# EasyEDA Pro project PCB_PCB_【CW32】芯源4轴飞行器_2022-08-28.eprj

# Board PCB_PCB_【CW32】芯源4轴飞行器_2022-08-28
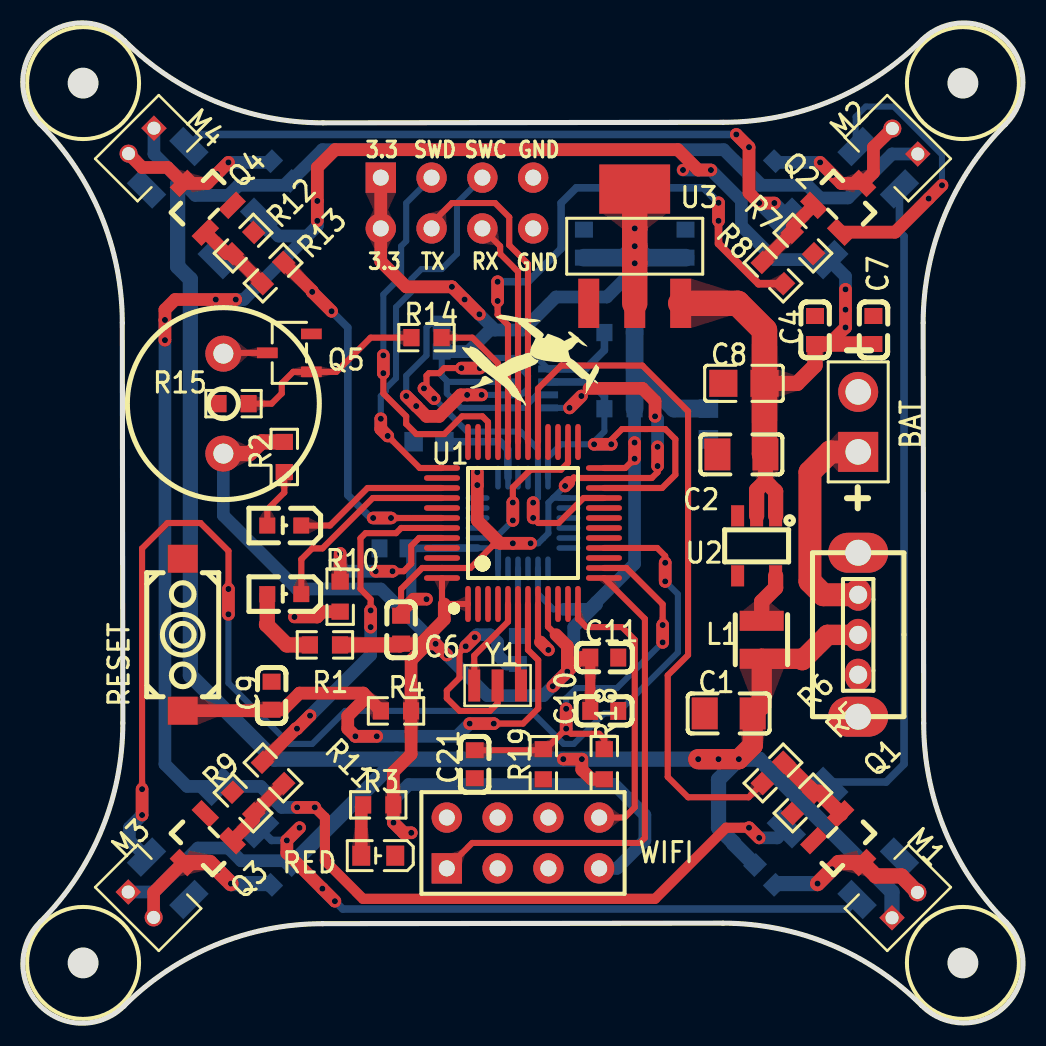
[diagram p0: board, top side]
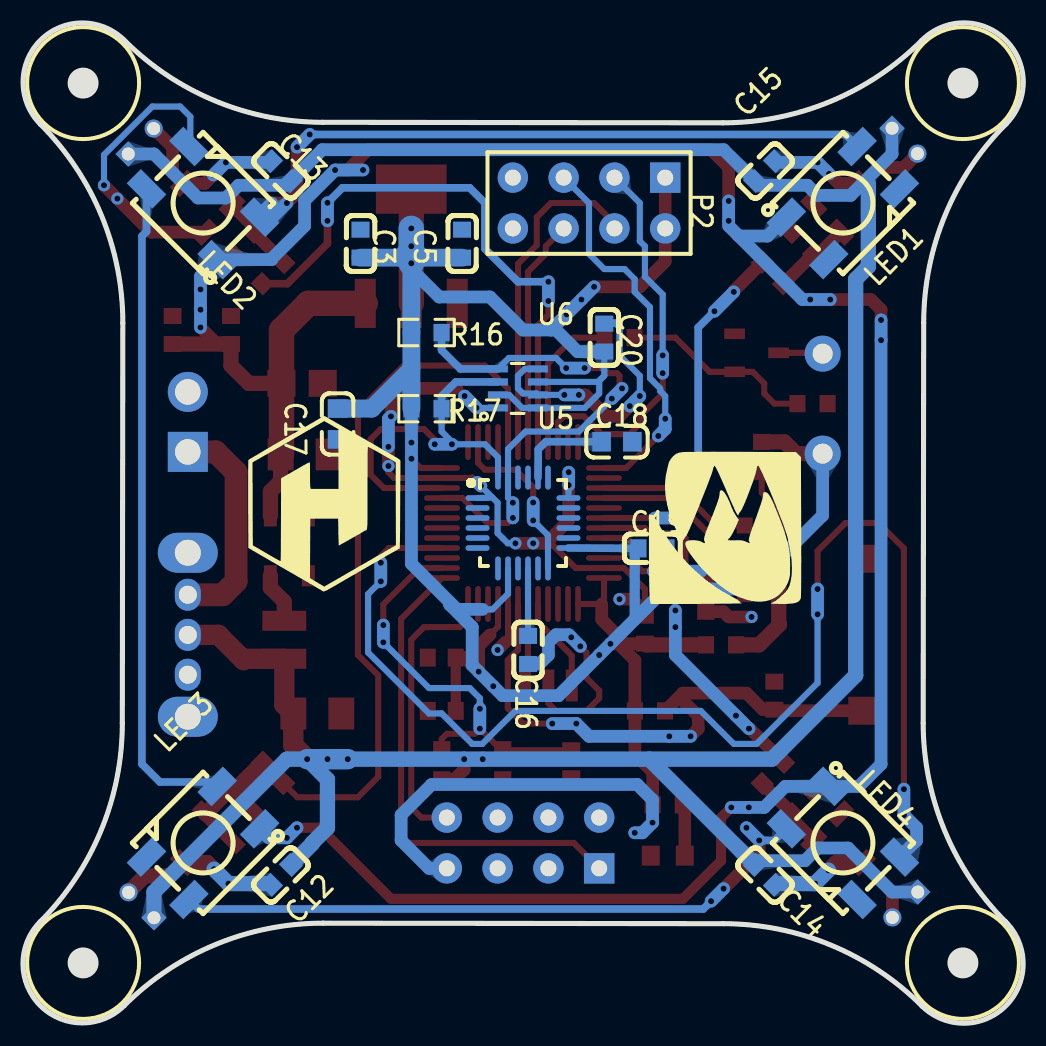
[diagram p1: board, bottom side, seen from below]

Outline 50.03 x 50.03 mm; copper layers: Top Layer, Bottom Layer. Coordinates in mm from the lower left corner of the outline.
Outline path: 0.86,44.97 arc(3.91,40.41) 4.98,35.03 5,15.02 arc(3.93,9.64) 0.89,5.08 arc(0.87,0.88) 5.06,0.86 5.06,0.86 arc(9.62,3.91) 15,4.98 35.02,5 arc(40.4,3.93) 44.96,0.89 arc(49.15,0.87) 49.17,5.06 arc(46.13,9.62) 45.06,15 45.03,35.02 arc(46.1,40.4) 49.15,44.96 arc(49.17,49.15) 44.97,49.17 arc(40.41,46.13) 35.03,45.06 15.02,45.03 arc(9.64,46.1) 5.08,49.15 arc(0.88,49.17) 0.86,44.97
Stack: Top Layer 0.035mm / Dielectric1 1.51mm FR4 er 4.5 / Bottom Layer 0.035mm

## Design rules (mm)
spacing Default (default): track to track 0.152, other pairs 0 to 0.152
track width Default (default): min 0.254, default 0.254, max 25.4
differential pair differentialPair (default): width min 0.127, default 0.254, max 2.54; gap min 0.152, default 0.152
via Default (default): diameter min 0.61, default 0.61, max 100.025; hole min 0.305, default 0.305, max 59.995
net GND uses gge22173
pour e870 uses gge22173

## Placement (name value [footprint] x y rotation side)
BAT  -  [R-BAT]  41.78 28.57 90 top
BUZZER1  HNB09A05  [BUZ-TH_BD9.6-P5.00-D0.7-FD]  10.03 30.99 90 top
C1  10uF  [C 1206]  35.3 15.49 180 top
C2  100uF  [C 1206]  35.94 28.45 180 top
C3  100nF  [C0603]  33.14 38.99 270 bottom
C4  100nF  [C0603]  39.62 34.67 270 top
C5  1uF  [C0603]  28.06 38.99 270 bottom
C6  100nF  [C0603]  18.92 19.68 90 top
C7  100nF  [C0603]  42.54 34.67 270 top
C8  10uF  [C0805]  36.07 32 0 top
C9  100nF  [C0603]  12.44 16.38 270 top
C10  1uF  [C0603]  29.08 15.62 0 top
C11  100nF  [C0603]  29.08 18.29 180 top
C12  4.7uF  [C0603]  37.12 7.42 135 bottom
C13  4.7uF  [C0603]  37.12 42.62 225 bottom
C14  4.7uF  [C0603]  12.92 7.42 45 bottom
C15  4.7uF  [C0603]  12.92 42.62 315 bottom
C16  100nF  [C0603]  24.76 18.67 90 bottom
C17  10nF  [C  0603]  34.29 29.97 270 bottom
C18  2.2nF  [C  0603]  20.32 29.08 180 bottom
C19  100nF  [C0603]  18.54 23.75 180 bottom
C20  100nF  [C0603]  20.95 34.29 270 bottom
C21  100nF  [C0603]  22.6 12.95 90 top
D1  LED_BLUE2  [LED0603-R-RD]  13.08 24.89 180 top
D7  LED_BLUE1  [LED0603-R-RD]  13.08 21.46 180 top
L1  22uH  [IND-SMD_L2.5-W2.0_SWPA252012S]  36.95 19.17 90 top
LED1  WS2812B  [LED-SMD_4P-L5.0-W5.0-TL]  9.02 41.02 135 bottom
LED2  WS2812B  [LED-SMD_4P-L5.0-W5.0-TL]  41.02 41.02 45 bottom
LED3  WS2812B  [LED-SMD_4P-L5.0-W5.0-TL]  41.02 9.02 315 bottom
LED4  WS2812B  [LED-SMD_4P-L5.0-W5.0-TL]  9.02 9.02 225 bottom
M1  PH2.0  [R-MOTOR]  44.12 5.92 45 top
M2  PH2.0  [R-MOTOR]  44.12 44.12 135 top
M3  PH2.0  [R-MOTOR]  5.92 5.92 315 top
M4  PH2.0  [R-MOTOR]  5.92 44.12 225 top
P2  扩展接口  [排针排母2*4P]  21.71 41.02 270 bottom
Q1  SI2302  [R-SOT-23]  41.12 8.92 135 top
Q2  SI2302  [R-SOT-23]  41.12 41.12 225 top
Q3  SI2302  [R-SOT-23]  8.92 8.92 45 top
Q4  SI2302  [R-SOT-23]  8.92 41.12 315 top
Q5  S8050_C2146  [SOT-23-3_L3.0-W1.7-P0.95-LS2.9-BR]  13.33 33.53 0 top
R1  2K  [R0603]  15.11 18.92 0 top
R2  2K  [R0603]  13.08 28.32 90 top
R3  2K  [R0603]  17.78 10.92 0 top
R4  10K  [R0603]  18.67 15.62 0 top
R5  10K  [R0603]  39.02 11.02 45 top
R6  100  [R0603]  37.52 12.52 225 top
R7  10K  [R0603]  39.02 39.02 135 top
R8  100  [R0603]  37.52 37.52 315 top
R9  10K  [R0603]  11.02 11.02 315 top
R10  10K  [R0603]  15.87 21.33 270 top
R11  100  [R0603]  12.52 12.52 135 top
R12  10K  [R0603]  11.02 39.02 225 top
R13  100  [R0603]  12.52 37.52 45 top
R14  1kΩ  [R0603]  20.19 34.29 180 top
R15  10K  [R0603]  10.54 30.99 0 top
R16  4.7kΩ  [R0603]  29.84 34.54 0 bottom
R17  4.7kΩ  [R0603]  29.84 30.73 0 bottom
R18  100kΩ  [R0603]  29.08 12.95 270 top
R19  10K  [R0603]  26.03 12.95 90 top
RED  19-21/R6C-FP1Q2L/3T  [LED0603-FD]  17.78 8.38 0 top
RESET  SWITCH  [KEY-SMD_2P-L6.2-W3.6-LS8.0]  8 19.43 270 top
SWITCH_POWER1  SS-12D02-VG4  [SW-TH_SS-12D02-VG4]  41.78 19.43 90 top
TP1  -  [M3铜柱]  3.02 47.02 0 top
TP2  -  [M3铜柱]  47.02 47.02 0 top
TP3  -  [M3铜柱]  3.02 3.02 0 top
TP4  -  [M3铜柱]  47.02 3.02 0 top
U1  CW32F030C8  [LQFP-48_L7.0-W7.0-P0.50-LS9.0-TL]  25.02 25.02 90 top
U2  R-ME2188C50M5G  [R-SOT-23-5]  36.7 23.87 270 top
U3  SC1117-3.3V  [SOT-223_L6.5-W3.5-P2.30-LS7.0-BR]  30.6 38.86 270 top
U5  MPU6050  [R-QFN 24]  25.02 25.02 270 bottom
U6  FBM320/BMP280  [R-BMP280]  25.27 31.75 0 bottom
WIFI  扩展接口  [排针排母2*4P]  25.02 9.01 90 top
Y1  8MHz  [R-CSTSE800G52]  23.75 16.89 0 top

## Footprints (pads in the part's own frame, mm; a bottom-side part is the same pattern mirrored in y, then rotated)
BUZ-TH_BD9.6-P5.00-D0.7-FD
  round 1.8 hole 1: 1(-2.5,0) 2(2.5,0)
C0603
  rect 0.8x0.9 smd: 1(-0.7,0) 2(0.7,0)
C0805
  rect 1.41x1.35 smd: 1(-1.03,0) 2(1.03,0)
C 1206
  rect 1.3x1.6 smd: 1(-1.2,0) 2(1.2,0)
C  0603
  custom 0.93x0.98 smd: 1(-0.769,0) 2(0.77,0)
IND-SMD_L2.5-W2.0_SWPA252012S
  rect 1x2.2 smd: 1(-0.951,0) 2(0.951,0)
KEY-SMD_2P-L6.2-W3.6-LS8.0
  rect 1.4x1.5 smd: 1(-3.8,0) 2(3.8,0)
LED0603-FD
  rect 0.9x1 smd: 1(-0.85,0) 2(0.85,0)
LED0603-R-RD
  rect 0.8x0.8 smd: 1(0.851,0) 2(-0.851,0)
LED-SMD_4P-L5.0-W5.0-TL
  rect 1.8x1 smd: 1(-2.5,1.5) 2(-2.5,-1.5) 3(2.5,-1.5) 4(2.5,1.5)
LQFP-48_L7.0-W7.0-P0.50-LS9.0-TL
  oval 1.8x0.28 smd: 1(-4.05,2.75) 2(-4.05,2.25) 3(-4.05,1.75) 4(-4.05,1.25) 5(-4.05,0.75) 6(-4.05,0.25) 7(-4.05,-0.25) 8(-4.05,-0.75) 9(-4.05,-1.25) 10(-4.05,-1.75) 11(-4.05,-2.25) 12(-4.05,-2.75) 25(4.05,-2.75) 26(4.05,-2.25) 27(4.05,-1.75) 28(4.05,-1.25) 29(4.05,-0.75) 30(4.05,-0.25) 31(4.05,0.25) 32(4.05,0.75) 33(4.05,1.25) 34(4.05,1.75) 35(4.05,2.25) 36(4.05,2.75)
  oval 0.28x1.8 smd: 13(-2.75,-4.05) 14(-2.25,-4.05) 15(-1.75,-4.05) 16(-1.25,-4.05) 17(-0.75,-4.05) 18(-0.25,-4.05) 19(0.25,-4.05) 20(0.75,-4.05) 21(1.25,-4.05) 22(1.75,-4.05) 23(2.25,-4.05) 24(2.75,-4.05) 37(2.75,4.05) 38(2.25,4.05) 39(1.75,4.05) 40(1.25,4.05) 41(0.75,4.05) 42(0.25,4.05) 43(-0.25,4.05) 44(-0.75,4.05) 45(-1.25,4.05) 46(-1.75,4.05) 47(-2.25,4.05) 48(-2.75,4.05)
R0603
  rect 0.806x0.864 smd: 1(-0.753,0) 2(0.753,0)
R-BAT
  rect 2x2 hole 1.275x1.27: 1(0,0)
  round 2 hole 1.275x1.27: 2(3,0)
R-BMP280
  custom 1x0.35 smd: 1(1.002,0.975) 2(1.002,0.325) 3(1.002,-0.325) 4(1.002,-0.975) 5(-1.002,-0.975) 6(-1.002,-0.325) 7(-1.002,0.325) 8(-1.002,0.975)
R-CSTSE800G52
  rect 0.6x1.6 smd: 1(-1.169,0) 2(1.169,0) 3(0,0)
R-MOTOR
  rect 0.9x0.9 hole 0.65x0.65: 1(-0.911,0)
  round 0.9 hole 0.65x0.65: 2(0.886,0)
R-QFN 24
  custom 0.28x1.199 smd: 1(-1.25,-2.273) 2(-0.75,-2.273) 3(-0.25,-2.273) 4(0.25,-2.273) 5(0.75,-2.273) 6(1.25,-2.273) 13(1.25,2.273) 14(0.75,2.273) 15(0.25,2.273) 16(-0.25,2.273) 17(-0.75,2.273) 18(-1.25,2.273)
  custom 1.199x0.28 smd: 7(2.273,-1.25) 8(2.273,-0.75) 9(2.273,-0.25) 10(2.273,0.25) 11(2.273,0.75) 12(2.273,1.25) 19(-2.273,1.25) 20(-2.273,0.75) 21(-2.273,0.25) 22(-2.273,-0.25) 23(-2.273,-0.75) 24(-2.273,-1.25)
R-SOT-23
  custom 0.7x1.25 smd: 1(1.25,-0.95) 2(1.25,0.95) 3(-1.25,0)
R-SOT-23-5
  rect 1.06x0.65 smd: 1(-1.5,0.95) 2(-1.5,0) 3(-1.5,-0.95) 4(1.5,-0.95) 5(1.5,0.95)
SOT-23-3_L3.0-W1.7-P0.95-LS2.9-BR
  rect 1.038x0.532 smd: 1(1.101,-0.95) 2(1.101,0.95) 3(-1.101,0)
SOT-223_L6.5-W3.5-P2.30-LS7.0-BR
  rect 2.465x1.05 smd: 1(2.857,-2.3) 2(2.857,0) 3(2.857,2.3)
  rect 2.465x3.54 smd: 4(-2.857,0)
SW-TH_SS-12D02-VG4
  oval 1.6x1.3 hole 0.9: 1(-2,0) 2(-0.006,0) 3(2,0)
  oval 2x3 hole 1.3: 4(4.1,0) 5(-4.1,0)
排针排母2*4P
  rect 1.52x1.52 hole 0.8: 1(-1.27,3.81)
  round 1.52 hole 0.8: 2(1.27,3.81) 3(-1.27,1.27) 4(1.27,1.27) 5(-1.27,-1.27) 6(1.27,-1.27) 7(-1.27,-3.81) 8(1.27,-3.81)

## Nets
3.3V: BUZZER1.1 C3.2 C5.2 C6.1 C10.1 C11.2 C17.1 C19.1 C20.2 P2.1 P2.2 R1.2 R2.2 R3.2 R4.2 R16.2 R17.2 U1.1 U1.9 U1.24 U1.48 U3.2 U3.4 U5.8 U5.13 U6.2 U6.6 U6.8 WIFI.7
3.7V: C1.1 C12.2 C13.2 C14.2 C15.2 L1.1 M1.1 M2.1 M3.1 M4.1 R18.2 SWITCH_POWER1.2
+5V: C2.1 C4.2 C7.2 C8.2 LED1.1 LED2.1 LED3.1 LED4.1 U2.1 U2.2 U3.3
GND: BAT.2 C1.2 C2.2 C3.1 C4.1 C5.1 C6.2 C7.1 C8.1 C9.1 C10.2 C11.1 C16.1 C17.2 C18.2 C19.2 C20.1 C21.1 LED1.3 LED2.3 LED3.3 LED4.3 P2.7 P2.8 Q1.2 Q2.2 Q3.2 Q4.2 Q5.2 R5.1 R7.1 R9.1 R10.2 R12.1 R15.1 R19.1 RED.2 RESET.1 U1.8 U1.23 U1.47 U2.4 U3.1 U5.1 U5.9 U5.11 U5.18 U6.1 U6.5 U6.7 WIFI.2 Y1.3
VBAT-T: C21.2 R18.1 R19.2 U1.14
BAT1_1: BAT.1 SWITCH_POWER1.3
BUZZER: R14.1 U1.33
D1_1: D1.1 R2.1
D7_1: D7.1 R1.1
INT: U1.26 U5.12
LED1_4: LED1.4 LED2.2
LED2_4: LED2.4 LED3.2
LED3_4: LED3.4 LED4.2
M1_2: C12.1 M1.2 Q1.3
PF0: U1.5 Y1.1
PF1: U1.6 Y1.2
PWM1: R6.2 U1.29
PWM2: R8.2 U1.32
PWM3: R13.2 U1.42
PWM4: R11.2 U1.43
Q1_1: Q1.1 R5.2 R6.1
Q2_3: C13.1 M2.2 Q2.3
Q3_3: C14.1 M3.2 Q3.3
Q4_3: C15.1 M4.2 Q4.3
Q5_1: Q5.1 R14.2 R15.2
Q5_3: BUZZER1.2 Q5.3
R3_1: R3.1 RED.1
R7_2: Q2.1 R7.2 R8.1
R9_2: Q3.1 R9.2 R11.1
R12_2: Q4.1 R12.2 R13.1
RGB: LED4.4 U1.16
RST: C9.2 R4.1 RESET.2 U1.7
RX_WIFI: U1.13 WIFI.1
RXD: P2.6 U1.31
SCL: R16.1 U1.21 U5.23 U6.4
SDA: R17.1 U1.22 U5.24 U6.3
SWCLK: P2.5 U1.37
SWDIO: P2.3 U1.34
TX_WIFI: U1.12 WIFI.8
TXD: P2.4 U1.30
U1_44: R10.1 U1.44
U2_5: L1.2 U2.5
U5_10: C16.2 U5.10
U5_20: C18.1 U5.20
USER_LED1: D7.2 U1.40
USER_LED2: D1.2 U1.39

Pads without a net: LED1 2; SWITCH_POWER1 1 4 5; U1 2 3 4 10 11 15 17 18 19 20 25 27 28 35 36 38 41 45 46; U2 3; U5 2 3 4 5 6 7 14 15 16 17 19 21 22; WIFI 3 4 5 6

## Via types
v1: diameter 0.61, hole 0.305, Top Layer to Bottom Layer, 114 vias

## Routing (per net, layer and track width the routed paths; a pad name or vN(x,y) marks a point on that pad's centre or on a via; arc(x,y) is an arc through that point)
3.3V: length 168.1
  Top Layer w0.305: 29.07,27.77 30.13,27.77 30.6,28.23 ; 20.96,22.27 20.96,21.19 21.22,20.97 22.27,20.97 ; 26.27,20.97 26.27,19.83 26.67,19.43
  Top Layer w0.508: C10.1 C11.2
  Top Layer w0.635: v1(26.51,16.85) v1(27.23,17.58) 27.23,18.86 26.67,19.43 ; v1(22.83,35.45) v1(22.1,36.19) v1(21.46,36.83) 19.17,36.83 17.9,38.1 P2.1 ; v1(19.43,9.52) 19.05,9.52 v1(18.54,10.03) 18.53,10.92 18.53,12.56 19.42,13.45 R4.2 19.42,18.15 20.24,18.97 v1(20.64,18.97) ; v1(20.64,18.97) v1(21.21,18.41) ; v1(20.64,18.97) C6.1 ; 19.89,18.98 21.08,20.19 21.08,20.97 ; 27.23,17.58 27.94,18.29 C11.2 ; v1(30.6,29.04) v1(30.6,28.23)
  Top Layer w0.762: BUZZER1.1 11.34,28.49 11.94,29.07 13.08,29.07 ; R1.2 18.86,18.92 C6.1
  Top Layer w1.27: U3.2 v1(30.6,38.01) v1(30.6,38.86) v1(30.6,39.75) U3.4
  Bottom Layer w0.305: 20.95,32.38 21.26,32.07 24.27,32.07 ; 20.95,32.38 21.21,32.13 21.21,31.49 21.93,30.77 25.06,30.77 25.71,31.42 U6.2 ; 20.95,32.38 C20.2 ; U5.8 25.77,21.47 26.54,20.7 27.05,20.7
  Bottom Layer w0.381: 22.74,23.77 19.24,23.75
  Bottom Layer w0.508: 19.43,20.19 19.43,23.56 19.24,23.75
  Bottom Layer w0.635: C20.2 22.28,33.59 23.37,34.67 23.62,34.67 ; 23.62,34.67 v1(22.83,35.45) v1(22.1,36.19) v1(21.46,36.83) ; 23.62,34.67 25.02,34.67 26.67,36.32 29.21,36.32 30.6,37.72 v1(30.6,38.01) ; BUZZER1.1 10.03,25.4 13.71,21.71 17.9,21.71 v1(20.64,18.97) v1(21.21,18.41) 23.24,16.38 26.03,16.38 v1(26.51,16.85) v1(27.23,17.58) 27.56,17.9 27.56,19.81 28.69,20.94 28.69,21.07 ; v1(19.43,9.52) 19.05,9.52 v1(18.54,10.03) 18.54,11.17 19.3,11.94 29.59,11.94 31.11,10.41 31.11,9.14 29.72,7.74 WIFI.7 ; R17.2 v1(30.6,29.04) v1(30.6,28.23) 30.6,22.98 28.32,20.7 27.05,20.7
  Bottom Layer w0.889: 33.14,38.29 31.15,38.29 30.6,38.83 ; 30.6,38.82 30.07,38.29 28.06,38.29 ; C17.1 32.58,30.74 30.6,32.72 ; v1(30.6,38.01) R16.2 R17.2
  Bottom Layer w1.27: v1(30.6,39.75) v1(30.6,38.01)
3.7V: length 148
  Top Layer w0.635: 27.03,13.21 v1(27.96,13.21) 27.96,12.67 28.45,12.2 R18.2
  Top Layer w1.016: SWITCH_POWER1.2 40.25,19.42 38.99,18.16 38.92,18.22 L1.1 36.95,15.94 C1.1 36.51,13.9 v1(35.81,13.21) v1(34.79,13.21) v1(33.78,13.21)
  Bottom Layer w0.635: C14.2 13.2,8.13 10.92,8.13 10.28,8.76 8.76,8.76 6.56,6.56 M3.1 ; 6.56,44.76 6.56,43.47 8.63,41.4 10.28,41.4 10.79,41.91 13.2,41.91 C15.2 14.98,43.69 35.06,43.69 C13.2 36.83,41.91 39.24,41.91 39.88,41.27 41.27,41.27 43.47,43.47 M2.1
  Bottom Layer w0.762: 27.03,13.21 v1(27.96,13.21) v1(33.78,13.21) ; v1(27.03,13.21) 18.7,13.21 ; 18.71,13.21 12.57,13.21 8.38,17.4 8.38,37.21 7.74,37.84 7.74,42.01 ; 18.7,13.21 C14.2 ; 43.47,5.27 43.47,6.56 36.83,13.21 v1(35.81,13.21) 34.8,12.19 34.8,9.78 35.56,9.01 35.56,8.98 C12.2
  Bottom Layer w1.016: v1(35.81,13.21) v1(34.79,13.21) v1(33.78,13.21)
+5V: length 140.4
  Top Layer w0.508: v1(36.32,9.78) 35.18,9.78 31.62,6.22 17.02,6.22 15.11,8.13 15.11,10.28 v1(14.6,10.79)
  Top Layer w0.635: C4.2 40.32,33.97 v1(41.15,34.8) v1(41.15,35.68) v1(41.15,36.7) ; v1(7.11,34.16) v1(7.11,35.17) 7.11,35.68 7.62,36.19 v1(9.65,36.19) v1(10.65,36.19) ; v1(14.73,40.13) v1(14.73,41.12) 14.73,42.8 15.62,43.69 32.76,43.69 33.78,42.67 v1(34.41,42.67) ; v1(36.32,9.78) v1(36.83,9.27) ; v1(13.72,10.79) v1(14.6,10.79)
  Top Layer w0.762: 37.09,32 38.73,32 39.62,32.89 C4.2 C7.2 ; 37.14,27.11 36.7,26.67 36.7,25.37 ; 37.14,27.11 37.65,26.59 37.65,25.37 ; 37.14,27.11 37.14,28.45
  Top Layer w1.27: 37.14,28.45 37.09,28.49 37.09,34.66 35.75,36 32.9,36
  Bottom Layer w0.635: v1(36.32,9.78) v1(36.83,9.27) 37.73,9.27 LED3.1 ; v1(13.72,10.79) v1(14.6,10.79) ; 14.22,39.37 12.79,39.37 LED1.1 ; 14.22,39.37 11.05,36.19 v1(10.65,36.19) v1(9.65,36.19) ; 14.22,39.37 14.73,39.88 v1(14.73,40.13) v1(14.73,41.12) ; v1(41.15,34.8) v1(41.15,35.68) v1(41.15,36.7) 41.15,37.35 40.31,38.19 37.59,38.19 37.59,38.22 35.94,39.88 35.94,41.15 v1(34.41,42.67) v1(33.02,42.67) ; 13.72,10.79 12.95,10.79 11.9,11.84 8.22,11.84 7.11,12.95 v1(7.11,34.16) v1(7.11,35.17)
GND: length 82.4
  Top Layer w0.305: U1.8 25.77,19.19 ; 27.59,27.27 U1.23 31.46,27.27 31.75,27.56 v1(31.75,27.87) ; 27.59,27.27 27.56,27.3 ; 27.59,27.27 27.37,27.05 27.3,27.05 ; Y1.3 23.75,16 23.37,15.62 21.84,15.62 21.21,16.25 21.21,16.63 21.84,17.27 21.84,18.54 v1(22.15,18.85) ; v1(24.51,24) 24.38,23.87 23.49,23.87 22.39,22.77 U1.47 19.97,22.77 18.92,21.71 C6.2 ; v1(27.94,31.37) 28.32,31.75
  Top Layer w0.635: v1(20.19,21.21) 19.56,21.21 18.92,20.57 C6.2 ; v1(25.4,24) v1(24.51,24) 23.87,24 22.73,25.14 v1(22.73,26.91) v1(22.73,27.56) ; v1(22.95,31.42) v1(22.22,31.42) 21.9,31.42 20.83,30.35 20.19,30.35 v1(19.68,30.86) v1(19.17,31.37) ; v1(31.62,30.35) 31.62,31.11 30.99,31.75 28.32,31.75 ; 27.3,27.05 v1(27.12,26.87) ; v1(27.94,31.37) v1(27.34,30.77) ; Q2.2 43.62,39.56 v1(45.3,41.24) v1(45.97,41.91) ; v1(22.15,18.85) v1(22.6,19.3) ; R10.2 14.99,20.58 14.73,20.32 v1(13.59,20.32) ; v1(26.29,18.67) 25.89,19.06 ; v1(31.75,27.87) v1(31.75,28.83)
  Bottom Layer w0.305: v1(45.97,41.91) 45.97,43.43 43.56,45.84 42.16,45.84 41.65,45.34 41.65,43.92 LED2.3 ; v1(25.4,24) 25.78,24 26.29,24.51 26.29,26.03 26.54,26.29 ; v1(22.95,31.42) U6.7 24.34,31.49 25.02,31.49 25.27,31.75 25.27,32.38 24.93,32.72 U6.5 ; 26.54,26.29 27.29,26.27 ; 26.54,26.29 v1(27.12,26.87) ; 26.27,30.77 v1(27.34,30.77) ; v1(19.17,31.37) 19.17,32.38 20.19,33.4 20.19,34.8 20.44,35.05 20.51,34.99 C20.1 ; v1(22.73,26.91) 22.74,26.27
  Bottom Layer w0.635: v1(27.34,30.77) v1(27.94,31.37) ; v1(22.95,31.42) v1(22.22,31.42) ; v1(31.75,28.83) 31.75,30.22 v1(31.62,30.35) ; v1(19.68,30.86) v1(19.17,31.37) ; C16.1 24.19,17.97 23.75,18.41 23.75,19.05 23.37,19.43 22.73,19.43 v1(22.6,19.3) v1(22.15,18.85) ; v1(27.12,26.87) 27.3,27.05 ; v1(22.73,27.56) v1(22.73,26.91)
VBAT-T: length 22.6
  Top Layer w0.305: v1(32,19.91) 32,20.95 30.19,22.77 29.07,22.77 ; R18.1 29.08,14.22 28.83,14.48 27.43,14.48 v1(27.18,14.73) 26.15,13.71 R19.2 25.98,13.65 C21.2
  Top Layer w0.635: v1(32,19.91) v1(32,19.05) ; v1(27.18,15.72) v1(27.18,14.73)
  Bottom Layer w0.305: v1(27.18,15.72) 27.18,16.25 27.68,16.76 29.72,16.76 v1(32,19.05)
  Bottom Layer w0.635: v1(27.18,15.72) v1(27.18,14.73) ; v1(32,19.91) v1(32,19.05)
BAT1_1: length 11
  Top Layer w1.143: SWITCH_POWER1.3 40.04,21.43 39.37,22.1 39.37,27.56 40.38,28.57 BAT.1
BUZZER: length 7.3
  Top Layer w0.305: R14.1 22.48,34.29 23.77,33 U1.33
D1_1: length 3
  Top Layer w0.305: D1.1 12.23,25.69 13.08,26.54 13.08,27.56
D7_1: length 4.1
  Top Layer w0.762: R1.1 13.21,18.92 12.19,19.94 12.23,19.97 D7.1
INT: length 9.6
  Top Layer w0.305: U1.26 27.27,28.03 26.92,27.68 25.4,27.68 24.51,26.79 v1(24.51,26.04)
  Top Layer w0.635: v1(24.51,26.04) v1(24.51,25.14)
  Bottom Layer w0.305: U5.12 23.77,24.4 v1(24.51,25.14)
  Bottom Layer w0.635: v1(24.51,26.04) v1(24.51,25.14)
LED1_4: length 35.8
  Top Layer w0.635: v1(37.59,41.02) v1(36.83,41.02) 36.32,41.53 v1(36.32,43.81) v1(35.68,44.45)
  Bottom Layer w0.381: LED2.2 37.54,40.31 ; LED1.4 8.89,44.45 v1(35.68,44.45)
  Bottom Layer w0.635: LED2.2 38.19,40.42 v1(37.59,41.02) ; 37.54,40.31 v1(36.83,41.02) ; v1(35.68,44.45) v1(36.32,43.81)
LED2_4: length 33.1
  Bottom Layer w0.381: LED2.4 43.85,39.59 44.07,39.36 44.07,12.96 43.18,12.06 40.53,12.06 40.31,11.84
LED3_4: length 34.8
  Top Layer w0.635: v1(15.61,6.1) v1(14.98,6.73) 13.21,8.51 v1(13.21,9.14) v1(13.84,9.78)
  Bottom Layer w0.381: v1(13.21,9.14) 12.44,9.14 LED4.2 ; v1(15.61,6.1) 16,5.71 41.25,5.71 LED3.4
  Bottom Layer w0.635: v1(15.61,6.1) v1(14.98,6.73) ; v1(13.21,9.14) v1(13.84,9.78)
M1_2: length 9.2
  Top Layer w0.762: v1(39.75,6.98) v1(40.47,7.7) 40.8,8.03 42,8.03 42.67,7.36 43.94,7.36 M1.2
  Bottom Layer w0.762: v1(40.47,7.7) v1(39.75,6.98) 37.67,6.98 37.61,6.92
PF0: length 4.8
  Top Layer w0.305: Y1.1 22.58,18.39 24.27,20.08 24.27,20.97
PF1: length 4.1
  Top Layer w0.305: Y1.2 24.77,17.04 24.77,20.97
PWM1: length 35.7
  Top Layer w0.305: U1.29 25.77,31.74 26.92,32.89 30.99,32.89 33.27,30.6 33.27,18.41 32.26,17.4 32.26,12.32 33.27,11.3 36.3,11.3 R6.2
PWM2: length 30.9
  Top Layer w0.305: v1(23.75,36.12) 23.75,35.43 24.27,34.91 U1.32
  Top Layer w0.381: v1(34.8,40.13) 34.8,38.99 36.8,36.99 38.05,36.99
  Top Layer w0.635: v1(34.8,41.03) v1(34.8,40.13) ; v1(23.75,36.12) v1(23.75,37.08)
  Bottom Layer w0.381: v1(34.8,41.03) 34.05,41.78 27.68,41.78 26.92,41.02 26.92,38.73 25.27,37.08 v1(23.75,37.08)
  Bottom Layer w0.635: v1(34.8,41.03) v1(34.8,40.13) ; v1(23.75,36.12) v1(23.75,37.08)
PWM3: length 20.3
  Top Layer w0.305: 20.96,25.27 19.43,25.27 ; 19.43,25.27 v1(18.41,25.27)
  Top Layer w0.635: R13.2 14.48,36.62 v1(14.48,36.57) v1(15.44,35.61) ; v1(18.41,25.27) v1(17.52,25.27)
  Bottom Layer w0.381: 17.4,25.27 16.25,26.41 16.25,34.8 v1(15.44,35.61)
  Bottom Layer w0.635: v1(15.44,35.61) v1(14.48,36.57) ; v1(18.41,25.27) v1(17.52,25.27)
PWM4: length 19.7
  Top Layer w0.305: 20.96,24.77 18.93,24.77 18.67,24.51 17.14,24.51 16.89,24.25 16.89,21.71 17.4,21.21 v1(17.4,20.64)
  Top Layer w0.635: v1(14.37,15.38) v1(13.71,14.73) 13.67,14.73 11.98,13.05 ; v1(17.4,20.64) v1(17.4,19.81)
  Bottom Layer w0.635: v1(13.71,14.73) v1(14.37,15.38) 17.4,18.41 v1(17.4,19.81) v1(17.4,20.64)
Q1_1: length 3.9
  Top Layer w0.762: 38.05,13.05 39.55,11.55 39.83,11.55 Q1.1
Q2_3: length 9.1
  Top Layer w0.635: 43.49,44.74 42.54,43.81 42.54,42.54 42,42 40.93,42 40.5,42.42 ; v1(40.5,42.42) v1(39.88,43.05)
  Bottom Layer w0.635: v1(40.5,42.42) v1(39.88,43.05) 37.67,43.05 37.61,43.11
Q3_3: length 9.2
  Top Layer w0.635: 6.54,5.29 6.54,6.54 8.03,8.03
  Top Layer w0.762: 9.74,7.65 9.36,8.03 8.03,8.03 ; v1(9.74,7.65) v1(10.41,6.98)
  Bottom Layer w0.762: v1(9.74,7.65) v1(10.41,6.98) 12.36,6.98 12.42,6.92
Q4_3: length 9
  Top Layer w0.635: M4.2 5.97,42.8 7.24,42.8 8.03,42 9.23,42 9.71,42.48 ; v1(9.71,42.48) v1(10.28,43.05)
  Bottom Layer w0.635: v1(9.71,42.48) v1(10.28,43.05) 12.36,43.05 12.42,43.11
Q5_1: length 9.8
  Top Layer w0.305: R15.2 12.44,30.99 12.95,31.49 12.95,32 13.53,32.58 Q5.1 15.68,32.58 17.4,34.29 R14.2
Q5_3: length 2.2
  Top Layer w0.305: BUZZER1.2 10.07,33.53 Q5.3
R3_1: length 2.6
  Top Layer w0.635: 16.93,8.38 16.93,10.82 17.02,10.92
R7_2: length 3.9
  Top Layer w0.635: R8.1 38.48,39.55 38.48,39.83 Q2.1
R9_2: length 3.9
  Top Layer w0.635: R11.1 R9.2 11.55,10.21 Q3.1
R12_2: length 3.9
  Top Layer w0.635: 11.98,36.99 10.48,38.48 10.21,38.48 9.13,39.56
RGB: length 66.9
  Top Layer w0.305: v1(5.97,11.71) 5.97,23.75 7.24,25.02 8.89,25.02 10.28,23.62 v1(10.28,21.71) ; 29.07,23.77 31.73,23.77 32.13,23.37 v1(32.13,23.03)
  Top Layer w0.635: v1(5.97,11.71) v1(5.97,10.41) ; v1(10.28,20.45) v1(10.28,21.71) ; v1(32.13,23.03) v1(32.13,22.1)
  Bottom Layer w0.305: v1(10.28,20.45) 10.28,17.02 13.33,13.97 14.48,13.97 16.13,15.62 25.4,15.62 27.05,13.97 27.56,13.97 29.08,15.49 29.72,15.49 32.76,18.54 32.76,21.46 v1(32.13,22.1)
  Bottom Layer w0.635: v1(10.28,20.45) v1(10.28,21.71) ; v1(32.13,23.03) v1(32.13,22.1) ; v1(5.97,11.71) v1(5.97,10.41) 5.33,9.78 5.33,9.14 6.19,8.31
RST: length 30.7
  Top Layer w0.305: 25.27,20.97 25.27,18.67 25.78,18.16 25.78,15.75 25.02,14.98 23.56,14.98
  Top Layer w0.635: RESET.2 12.39,15.63 C9.2 13.01,15.68 13.84,16.51 17.02,16.51 R4.1 ; v1(17.7,14.35) v1(16.63,14.35) 16.25,14.73 16.25,15.36 17.02,16.14 17.02,16.51 ; v1(23.55,14.98) v1(22.35,14.98)
  Bottom Layer w0.635: v1(23.55,14.98) v1(22.35,14.98) 21.71,14.35 v1(17.7,14.35) v1(16.63,14.35)
RX_WIFI: length 24.4
  Top Layer w0.305: WIFI.1 22.48,9.01 30.86,9.01 31.11,9.27 31.11,20.22 29.07,22.27
RXD: length 11.4
  Top Layer w0.305: 22.98,39.75 23.87,38.86 23.87,38.48 24.77,37.58 24.77,29.07
SCL: length 28.5
  Top Layer w0.305: v1(20.06,31.75) 20.19,31.87 20.19,32.38 20.32,32.51 20.83,32.51 21.08,32.76 v1(21.94,32.76) ; v1(25.52,25.27) 25.78,25.02 26.79,25.02 28.04,26.27 U1.21
  Top Layer w0.635: v1(21.94,32.76) v1(22.86,32.76) ; v1(25.52,25.27) v1(25.52,26.03) ; v1(20.58,31.24) v1(20.06,31.75)
  Bottom Layer w0.305: v1(25.52,26.03) 25.77,26.27 U5.23 25.77,28.71 24.89,29.59 22.22,29.59 21.15,30.66 ; v1(22.86,32.76) 23.37,33.27 25.72,33.27 U6.4 ; 21.15,30.66 v1(20.58,31.24)
  Bottom Layer w0.381: U6.4 28.15,32.72 29.09,33.66 R16.1
  Bottom Layer w0.635: v1(25.52,25.27) v1(25.52,26.03) ; v1(21.94,32.76) v1(22.86,32.76) ; v1(20.58,31.24) v1(20.06,31.75)
SDA: length 21.2
  Top Layer w0.305: 31.09,29.72 32.13,29.72 32.64,29.21 32.64,27.43 31.97,26.77 U1.22 ; 29.08,28.95 v1(28.57,28.95) ; v1(29.43,28.95) 29.43,29.18 29.97,29.72 31.24,29.72
  Top Layer w0.635: v1(29.43,28.95) v1(28.57,28.95)
  Bottom Layer w0.305: R17.1 29.09,29.6 28.57,29.08 v1(28.57,28.95) 26.92,28.95 26.27,28.3 U5.24
  Bottom Layer w0.381: 26.27,32.07 28.37,32.07 29.09,31.36 R17.1
  Bottom Layer w0.635: v1(29.43,28.95) v1(28.57,28.95)
SWCLK: length 20.1
  Top Layer w0.305: v1(18.25,29.37) 19.85,27.77 20.96,27.77
  Top Layer w0.635: v1(17.9,30.23) 17.9,29.72 v1(18.25,29.37)
  Bottom Layer w0.305: P2.5 21.71,41.02 21.71,38.48 20.95,37.72 19.94,37.72 19.43,37.21 19.43,36.57 18.67,35.81 18.67,32.26 18.16,31.75 18.16,31.62 17.9,31.37 v1(17.9,30.23)
  Bottom Layer w0.635: v1(17.9,30.23) 17.9,29.72 v1(18.25,29.37)
SWDIO: length 20.5
  Top Layer w0.305: U1.34 23.27,30.07 22.98,30.35 21.97,30.35 21.08,29.46 19.68,29.46 19.17,29.97 19.17,30.35 18.03,31.49 v1(18.03,32.51)
  Top Layer w0.635: v1(18.03,32.51) v1(18.03,33.4)
  Bottom Layer w0.305: P2.3 19.17,41.02 19.17,39.11 18.92,38.86 18.92,37.34 18.03,36.45 v1(18.03,33.4)
  Bottom Layer w0.635: v1(18.03,32.51) v1(18.03,33.4)
TX_WIFI: length 14.4
  Top Layer w0.305: 27.77,20.97 27.77,20.23 28.19,19.81 29.97,19.81 30.6,19.17 30.6,10.79 30.1,10.28 WIFI.8
TXD: length 16.6
  Top Layer w0.305: 20.44,39.75 20.44,40 21.46,41.02 23.62,41.02 24.33,40.31 24.33,38.91 25.27,37.97 25.27,34.38 ; 25.27,29.07 25.27,34.54
U1_44: length 9.5
  Top Layer w0.305: v1(18.49,22.6) 19.05,22.6 19.43,22.98 19.43,23.87 19.82,24.27 20.96,24.27 ; 17.9,22.6 v1(17.65,22.6)
  Top Layer w0.635: 18.49,22.6 v1(17.65,22.6) ; v1(15.87,23.49) R10.1
  Bottom Layer w0.635: v1(15.87,23.49) 15.87,22.86 16.13,22.6 v1(17.65,22.6) 18.49,22.6
U2_5: length 2.5
  Top Layer w0.762: 36.95,20.12 36.95,21.08 37.65,21.78 37.65,22.38
U5_10: length 3.4
  Bottom Layer w0.305: 24.77,22.74 C16.2
U5_20: length 4.7
  Bottom Layer w0.381: C18.1 23.87,29.08 24.25,28.7 U5.20
USER_LED1: length 10
  Top Layer w0.305: D7.2 13.93,23.2 14.48,23.75 14.98,23.75 17.5,26.27 20.96,26.27
USER_LED2: length 7.8
  Top Layer w0.305: 20.96,26.77 17.24,26.77 15.36,24.89 D1.2

## Copper pours and planes (outline as drawn; the poured copper is in the pictures)
GND on Top Layer: -4.96,53.08 53.72,53.08 53.59,52.96 53.59,-2.67 52.96,-2.03 -4.96,-2.03
GND on Bottom Layer: -7.37,55.37 -7.24,55.5 56.13,55.5 56.13,-5.34 -7.37,-5.34

Small or netless copper shapes (teardrops, artwork), in the pictures only: 106 on Top Layer, 60 on Bottom Layer

## Text on the board
Top Silkscreen Layer: 3.3 | SWD | TX | SWC | RX | GND
